# EAGLE design board_RA-02_v2 (EAGLE 7.7.0)
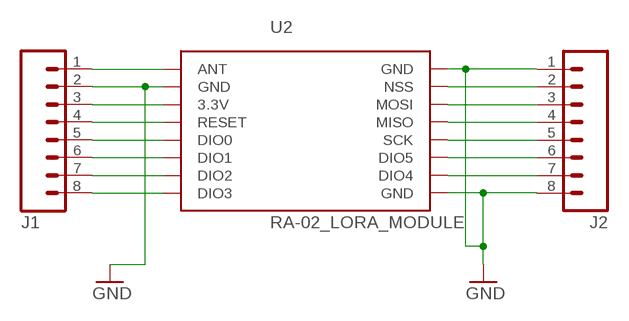
[diagram p0: schematic, sheet 1]

## Parts
J1  M08  [1X08_ROUND]
J2  M08  [1X08_ROUND]
U2  RA-02_LORA_MODULE  [RA-02]

## Nets
ANT: J1.1 U2.ANT
GND: J1.2 J2.1 J2.8 U2.GND@2(GND) U2.GND@3(GND) U2.GND@4(GND)
N$1: J1.3 U2.3.3V
N$2: J1.4 U2.RESET
N$3: J1.5 U2.DIO0
N$4: J1.6 U2.DIO1
N$5: J1.7 U2.DIO2
N$6: J1.8 U2.DIO3
N$7: J2.2 U2.NSS
N$8: J2.3 U2.MOSI
N$9: J2.4 U2.MISO
N$10: J2.5 U2.SCK
N$11: J2.6 U2.DIO5
N$12: J2.7 U2.DIO4

## Library data of the parts
J1 J2 = SparkFun-Connectors:M08: Header 8 Standard 8-pin 0.1" header. Use with straight break away headers (SKU : PRT-00116), right angle break away headers (PRT-00553), swiss pins (PRT-00743), machine pins (PRT-00117), and female headers (PRT-00115).; PROD_ID: CONN-08437
U2 = RA-02_Lora_module:RA-02_LORA_MODULE

## Net classes
1 rf: clearance 0.5 mm

## Board
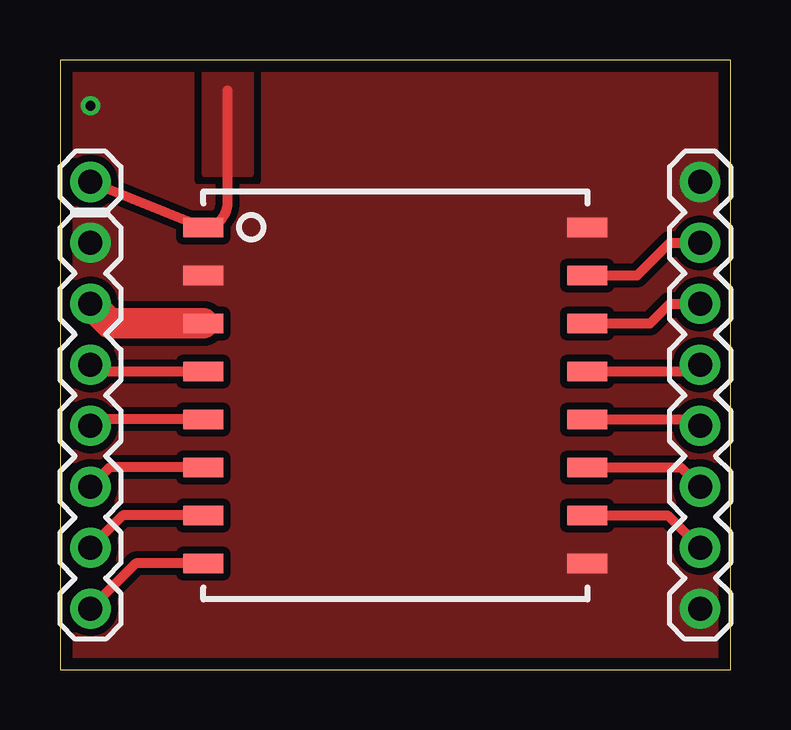
[diagram p1: board, top side]
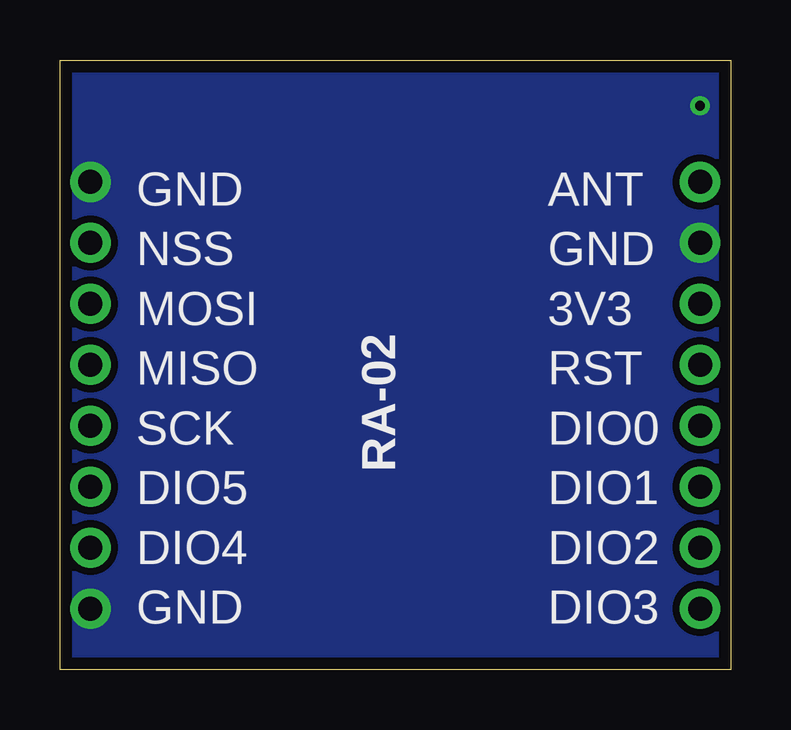
[diagram p2: board, bottom side, seen from below]

Size 27.94 x 25.4 mm. Coordinates in mm from the lower left corner, seen from the top.
Outline: 0,0 27.94,0 27.94,25.4 0,25.4 0,0
Copper layers (1*16): Top 0.035mm / dielectric 1.5mm / Bottom 0.035mm
Design rules "default *": minimum track width 10mil, minimum drill 0.4mm, track to track 0.3mm, track to pad 0.3mm, pad to pad 0.3mm, via to via 0.3mm, smd to smd 8mil, copper to edge 0.5mm, drill to drill 8mil, minimum pad ring 10mil, minimum via ring 8mil, stop-mask expansion 4mil, vias tented up to drill 0.8mm, thermal gap 10mil

### Footprints (pad centres in the part's own frame; a part is rotated, then mirrored left to right if it is on the bottom)
1X08_ROUND = drill 1 pad 1.676: 1 0,0; 2 2.54,0; 3 5.08,0; 4 7.62,0; 5 10.16,0; 6 12.7,0; 7 15.24,0; 8 17.78,0
RA-02 = smd 1.676 x 0.813: 3.3V -8,3; ANT -8,7; DIO0 -8,-1; DIO1 -8,-3; DIO2 -8,-5; DIO3 -8,-7; DIO4 8,-5; DIO5 8,-3; GND@2 -8,5; GND@3 8,-7; GND@4 8,7; MISO 8,1; MOSI 8,3; NSS 8,5; RESET -8,1; SCK 8,-1

### Placement (x,y rotation side)
J1  1.27,20.32 270 top
J2  26.67,20.32 270 top
U2  13.97,11.43 0 top

### Tracks (layer width: path | path; a pad name or v marks a point on that pad's centre or on a via)
ANT
  Top 0.406: 6.99,24.13 6.99,19.45 arc-90 U2.ANT J1.1
  pour Top (isolate 0.305, no thermals): 6.03,25.4 7.94,25.4 7.94,20.64 6.03,20.64
GND  (via drill 0.4)
  other vias: 1.27,23.5
  pour Bottom (isolate 0.254, rank 3, no thermals): 0,25.4 27.94,25.4 27.94,0 0,0
  pour Top (isolate 0.254, rank 3, no thermals): 0,25.4 27.94,25.4 27.94,0 0,0
N$1
  Top 1.27: J1.3 2.08,14.43 U2.3.3V
N$2
  Top 0.406: J1.4 1.54,12.43 U2.RESET
N$3
  Top 0.406: U2.DIO0 1.54,10.43 J1.5
N$4
  Top 0.406: U2.DIO1 2.08,8.43 J1.6
N$5
  Top 0.406: U2.DIO2 2.62,6.43 J1.7
N$6
  Top 0.406: U2.DIO3 3.16,4.43 J1.8
N$7
  Top 0.406: U2.NSS 24.05,16.43 25.4,17.78 J2.2
N$8
  Top 0.406: U2.MOSI 24.59,14.43 25.4,15.24 J2.3
N$9
  Top 0.406: U2.MISO 26.4,12.43 J2.4
N$10
  Top 0.406: U2.SCK 26.4,10.43 J2.5
N$11
  Top 0.406: U2.DIO5 25.86,8.43 J2.6
N$12
  Top 0.406: U2.DIO4 25.32,6.43 J2.7

### Text on the board
bPlace: RA-02 | ANT / GND / 3V3 / RST / DIO0 / DIO1 / DIO2 / DIO3 | GND / NSS / MOSI / MISO / SCK / DIO5 / DIO4 / GND